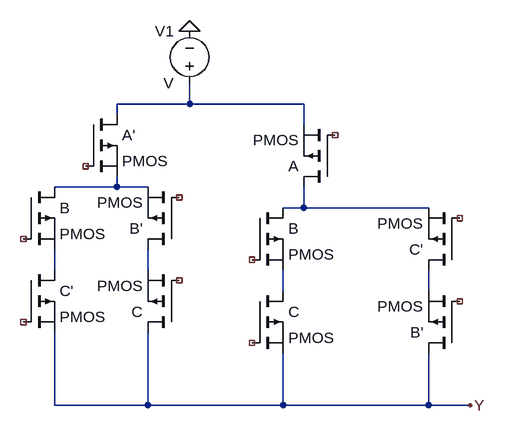
[diagram p0: schematic Draft1.asc]
Draft1.asc, the LTspice schematic file:
Version 4.1
SHEET 1 880 680
WIRE 256 0 256 -32
WIRE 256 0 144 0
WIRE 432 0 256 0
WIRE 144 16 144 0
WIRE 432 32 432 0
WIRE 144 128 144 112
WIRE 144 128 48 128
WIRE 192 128 144 128
WIRE 432 160 432 128
WIRE 432 160 400 160
WIRE 624 160 432 160
WIRE 48 256 48 224
WIRE 192 256 192 224
WIRE 400 288 400 256
WIRE 624 288 624 256
WIRE 48 464 48 352
WIRE 192 464 192 352
WIRE 192 464 48 464
WIRE 400 464 400 384
WIRE 400 464 192 464
WIRE 624 464 624 384
WIRE 624 464 400 464
WIRE 688 464 624 464
FLAG 256 -112 0
FLAG 688 464 Y
SYMBOL pmos 96 16 R0
SYMATTR InstName A'
SYMBOL pmos 0 128 R0
SYMATTR InstName B
SYMBOL pmos 240 224 R180
SYMATTR InstName B'
SYMBOL pmos 672 384 R180
SYMATTR InstName B'
SYMBOL pmos 480 128 R180
SYMATTR InstName A
SYMBOL pmos 352 160 R0
SYMATTR InstName B
SYMBOL pmos 352 288 R0
SYMATTR InstName C
SYMBOL pmos 0 256 R0
SYMATTR InstName C'
SYMBOL pmos 240 352 R180
SYMATTR InstName C
SYMBOL pmos 672 256 R180
SYMATTR InstName C'
SYMBOL voltage 256 -16 R180
WINDOW 0 24 96 Left 2
WINDOW 3 24 16 Left 2
SYMATTR InstName V1

The netlist it stands for:
* Draft1.asc
M§A' N001 NC_01 N002 N002 PMOS
M§B N002 NC_02 N004 N004 PMOS
M§B' N005 NC_03 N002 N002 PMOS
M§B' Y NC_04 N007 N007 PMOS
M§A N003 NC_05 N001 N001 PMOS
M§B N003 NC_06 N006 N006 PMOS
M§C N006 NC_07 Y Y PMOS
M§C' N004 NC_08 Y Y PMOS
M§C Y NC_09 N005 N005 PMOS
M§C' N007 NC_10 N003 N003 PMOS
V1 N001 0 V
.model NMOS NMOS
.model PMOS PMOS
.lib standard.mos
.backanno
.end